# EasyEDA Pro project sensor_board.eprj

# Schematic Schematic1
Board Name: Board1; Create Date: 2025-07-16; Page Name: P1; Project Name: sensor_board; Schematic Name: Schematic1; Update Date: 2025-07-16; Company: EasyEDA.com; Page Size: A4; Version: V1.0
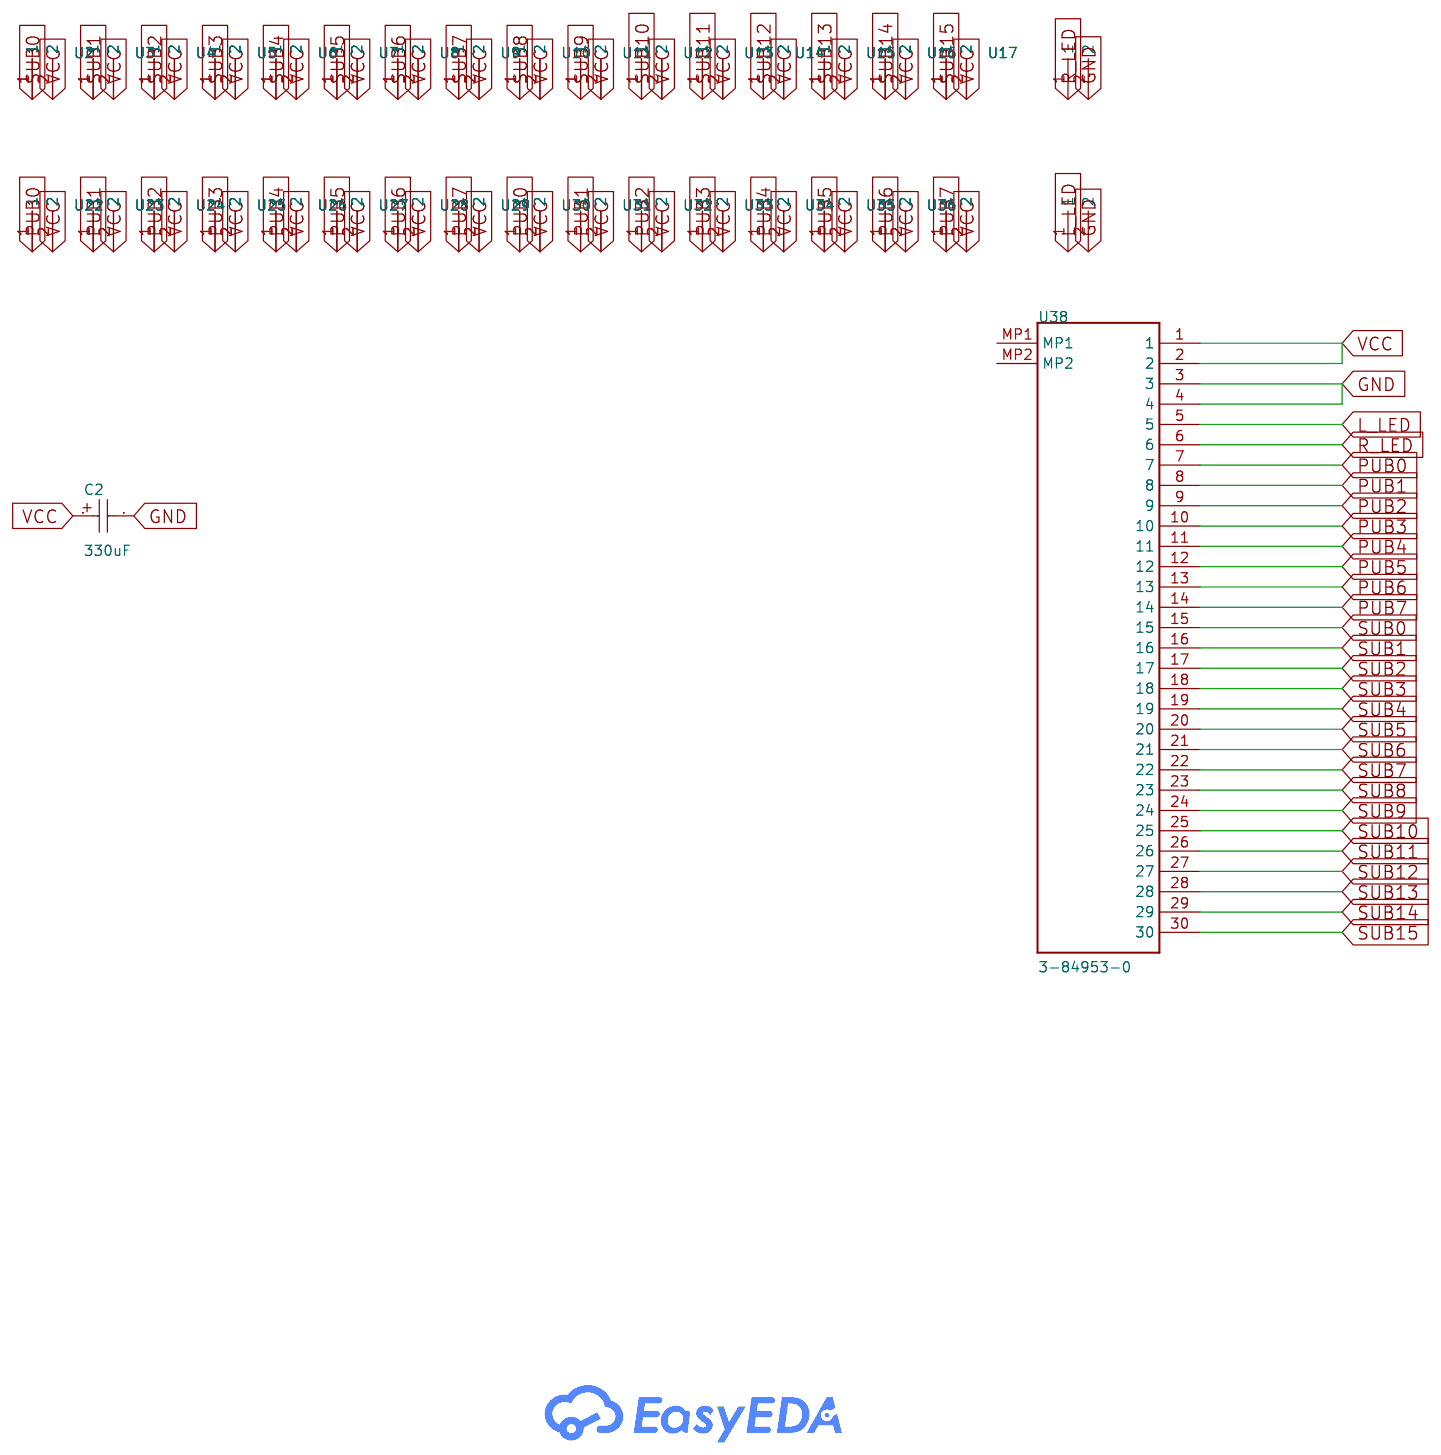
[diagram p0: schematic sheet]

## Parts
C2  330uF  [CASE-D_7343]
U2  -  [pub_pin]
U3  -  [pub_pin]
U4  -  [pub_pin]
U5  -  [pub_pin]
U6  -  [pub_pin]
U7  -  [pub_pin]
U8  -  [pub_pin]
U9  -  [pub_pin]
U10  -  [pub_pin]
U11  -  [pub_pin]
U12  -  [pub_pin]
U13  -  [pub_pin]
U14  -  [pub_pin]
U15  -  [pub_pin]
U16  -  [pub_pin]
U17  -  [pub_pin]
U18  -  [pub_pin]
U21  -  [pub_pin]
U22  -  [pub_pin]
U23  -  [pub_pin]
U24  -  [pub_pin]
U25  -  [pub_pin]
U26  -  [pub_pin]
U27  -  [pub_pin]
U28  -  [pub_pin]
U29  -  [pub_pin]
U30  -  [pub_pin]
U31  -  [pub_pin]
U32  -  [pub_pin]
U33  -  [pub_pin]
U34  -  [pub_pin]
U35  -  [pub_pin]
U36  -  [pub_pin]
U37  -  [pub_pin]
U38  3-84953-0  [3849530]

## Library data of the parts
C2 = TAJD337M006RNJ: Capacitance: Tolerance:±20% Tolerance:±20% Rated Voltage: Equivalent Series Resistance(ESR):400mΩ@100kHz Operating Temperature:-55℃~+125℃ Operating Temperature:-55℃~+125℃; LCSC Part Name: 330uF ±20% 6.3V; Supplier Part: C22283; Manufacturer: Kyocera AVX; Supplier Footprint: CASE-D-7343; JLCPCB Part Class: Extended Part; Datasheet: https://atta.szlcsc.com/upload/public/pdf/source/20160107/1457707750344.pdf; Supplier: LCSC; Tolerance: ±20%; Equivalent Series Resistance(ESR): 400mΩ@100kHz; Operating Temperature: -55℃~+125℃
U2-U18 U21-U37 = pub_pin
U38 = 3-84953-0

## Nets
GND: C2.2 U18.2 U21.2 U38.3 U38.4
VCC: C2.1 U2.2 U3.2 U4.2 U5.2 U6.2 U7.2 U8.2 U9.2 U10.2 U11.2 U12.2 U13.2 U14.2 U15.2 U16.2 U17.2 U22.2 U23.2 U24.2 U25.2 U26.2 U27.2 U28.2 U29.2 U30.2 U31.2 U32.2 U33.2 U34.2 U35.2 U36.2 U37.2 U38.1 U38.2
L_LED: U21.1 U38.5
PUB0: U22.1 U30.1 U38.7
PUB1: U23.1 U31.1 U38.8
PUB2: U24.1 U32.1 U38.9
PUB3: U25.1 U33.1 U38.10
PUB4: U26.1 U34.1 U38.11
PUB5: U27.1 U35.1 U38.12
PUB6: U28.1 U36.1 U38.13
PUB7: U29.1 U37.1 U38.14
R_LED: U18.1 U38.6
SUB0: U2.1 U38.15
SUB1: U3.1 U38.16
SUB2: U4.1 U38.17
SUB3: U5.1 U38.18
SUB4: U6.1 U38.19
SUB5: U7.1 U38.20
SUB6: U8.1 U38.21
SUB7: U9.1 U38.22
SUB8: U10.1 U38.23
SUB9: U11.1 U38.24
SUB10: U12.1 U38.25
SUB11: U13.1 U38.26
SUB12: U14.1 U38.27
SUB13: U15.1 U38.28
SUB14: U16.1 U38.29
SUB15: U17.1 U38.30

Not connected (* = marked no-connect by the designer): U38 MP1 MP2

# Board PCB1
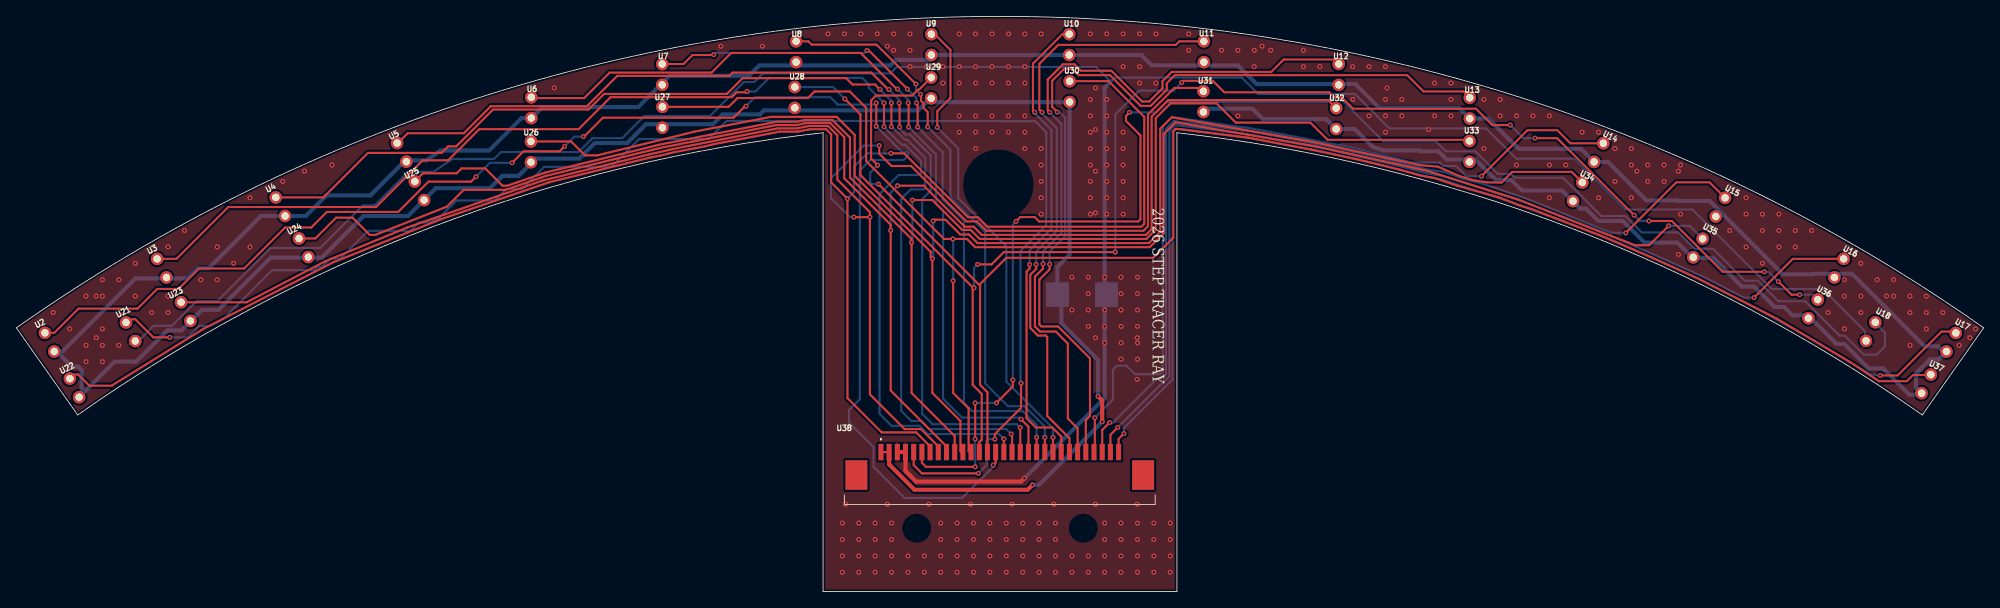
[diagram p1: board, top side]
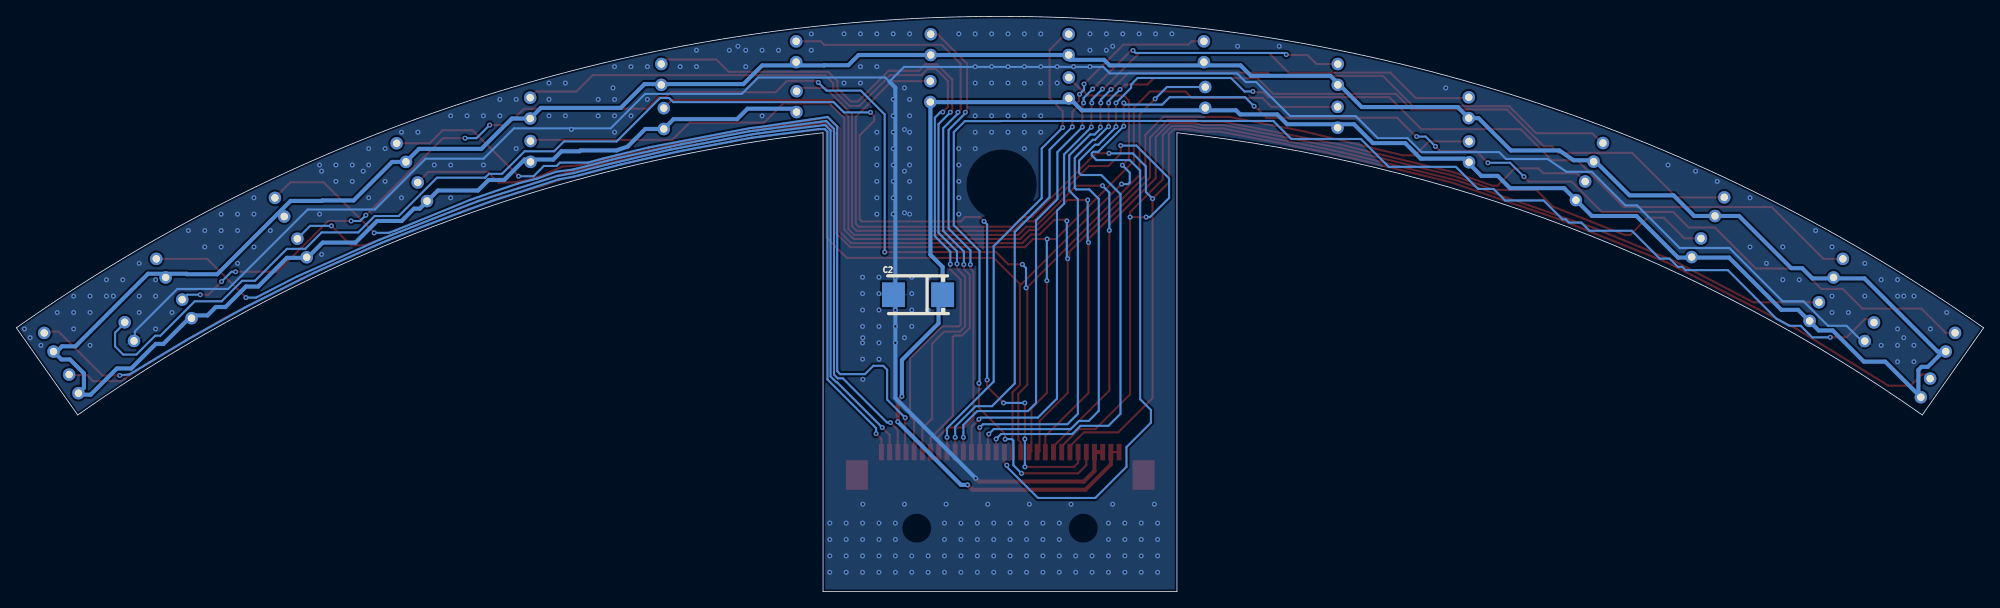
[diagram p2: board, bottom side, seen from below]

Outline 240.02 x 70.19 mm; copper layers: Top Layer, Bottom Layer. Coordinates in mm from the lower left corner of the outline.
Outline path: 0,32.19 7.48,21.56 arc(50.78,44.52) 98.42,55.99 98.42,0 141.6,0 141.6,55.99 arc(189.24,44.52) 232.53,21.56 240.02,32.19 arc(120.01,70.19) 0,32.19
Stack: Top Layer 0.035mm / Dielectric1 1.51mm FR4 er 4.5 / Bottom Layer 0.035mm

## Design rules (mm)
net VCC: VCC
template: JLCPCB Capability(Two Layers Board)
spacing copperThickness1oz (default): track to track 0.102, other pairs 0.152 to 0.3
spacing copperThickness2oz: track to track 0.203, other pairs 0.152 to 0.3
track width copperThickness1oz (default): min 0.127, default 0.254, max 2.54
track width copperThickness2oz: min 0.203, default 0.254, max 2.54
differential pair differentialPair (default): width min 0.127, default 0.254, max 2.54; gap min 0.152, default 0.152
via viaSize (default): diameter min 0.5, default 0.61, max 10; hole min 0.3, default 0.305, max 6.3

## Placement (name value [footprint] x y rotation side)
C2  330uF  [CASE-D_7343]  130.01 36.23 180 bottom
U2  -  [pub_pin]  23.76 24.25 26.6 top
U3  -  [pub_pin]  37.45 33.28 26.6 top
U4  -  [pub_pin]  51.92 40.78 26.6 top
U5  -  [pub_pin]  66.72 47.41 26.6 top
U6  -  [pub_pin]  77.68 44.69 0 top
U7  -  [pub_pin]  93.65 48.75 0 top
U8  -  [pub_pin]  109.99 51.52 0 top
U9  -  [pub_pin]  126.49 52.39 0 top
U10  -  [pub_pin]  143.32 52.39 0 top
U11  -  [pub_pin]  159.74 51.52 0 top
U12  -  [pub_pin]  176.19 48.75 0 top
U13  -  [pub_pin]  192.19 44.64 0 top
U14  -  [pub_pin]  199.93 34.09 333.4 top
U15  -  [pub_pin]  214.78 27.43 333.4 top
U16  -  [pub_pin]  229.25 19.99 333.4 top
U17  -  [pub_pin]  242.93 10.95 333.4 top
U18  -  [pub_pin]  233.11 12.25 333.4 top
U21  -  [pub_pin]  33.65 25.52 26.6 top
U22  -  [pub_pin]  26.8 18.67 26.6 top
U23  -  [pub_pin]  40.37 27.98 26.6 top
U24  -  [pub_pin]  54.76 35.77 26.6 top
U25  -  [pub_pin]  68.89 42.72 26.6 top
U26  -  [pub_pin]  77.64 39.31 0 top
U27  -  [pub_pin]  93.68 43.53 0 top
U28  -  [pub_pin]  109.83 45.95 0 top
U29  -  [pub_pin]  126.47 47.11 0 top
U30  -  [pub_pin]  143.37 46.66 0 top
U31  -  [pub_pin]  159.69 45.44 0 top
U32  -  [pub_pin]  175.89 43.37 0 top
U33  -  [pub_pin]  192.15 39.36 0 top
U34  -  [pub_pin]  197.36 29.31 333.4 top
U35  -  [pub_pin]  212.04 22.45 333.4 top
U36  -  [pub_pin]  226.09 15.02 333.4 top
U37  -  [pub_pin]  239.89 5.87 333.4 top
U38  3-84953-0  [3849530]  119.98 16.03 0 top

## Footprints (pads in the part's own frame, mm; a bottom-side part is the same pattern mirrored in y, then rotated)
3849530
  rect 0.61x2 smd: 1(-14.5,1) 2(-13.5,1) 3(-12.5,1) 4(-11.5,1) 5(-10.5,1) 6(-9.5,1) 7(-8.5,1) 8(-7.5,1) 9(-6.5,1) 10(-5.5,1) 11(-4.5,1) 12(-3.5,1) 13(-2.5,1) 14(-1.5,1) 15(-0.5,1) 16(0.5,1) 17(1.5,1) 18(2.5,1) 19(3.5,1) 20(4.5,1) 21(5.5,1) 22(6.5,1) 23(7.5,1) 24(8.5,1) 25(9.5,1) 26(10.5,1) 27(11.5,1) 28(12.5,1) 29(13.5,1) 30(14.5,1)
  rect 2.68x3.6 smd: MP1(-17.49,-1.8) MP2(17.49,-1.8)
CASE-D_7343
  rect 2.799x3.01 smd: 1(3,0) 2(-3,0)
pub_pin
  round 1.524 hole 0.914: 1(-14.859,15.621) 2(-14.859,13.081)

## Nets
As in the schematic.

Pads without a net: U38 MP1 MP2

## Via types
v1: diameter 0.61, hole 0.305, Top Layer to Bottom Layer, 409 vias

## Routing (per net, layer and track width the routed paths; a pad name or vN(x,y) marks a point on that pad's centre or on a via; arc(x,y) is an arc through that point)
GND: length 311
  Top Layer w0.5: v1(122.98,13.83) 122.58,13.43 109.78,13.43 108.48,14.73 U38.4 U38.3
  Bottom Layer w0.254: 225.57,30.59 225.57,31.74 220.38,36.93 214.18,36.93 204.48,46.63 196.28,46.63 190.08,52.83 183.01,52.83 179.31,56.53 167.51,56.53 163.31,60.73 151.51,60.73 149.51,62.73 134.01,62.73 133.51,62.23 131.71,64.03 107.41,64.03 106.61,63.23 91.08,63.23 90.03,62.18 88.76,62.18 84.61,58.03 76.61,58.03 73.91,55.33 70.28,55.33 68.58,53.63 59.11,53.63 58.27,52.79 53.2,52.79 50.89,51.23 47.81,51.23 43.71,47.13 42.28,47.13 37.08,41.93 31.01,41.93 24.51,35.43 21.98,35.43 18.98,32.43 16.71,32.43 14.75,30.47 14.61,30.47 U21.2
  Bottom Layer w0.5: 133.51,62.23 132.78,61.5 132.78,23.63 v1(122.98,13.83)
  vias: v1(4.5,34.05) v1(6.5,32.05) v1(8.5,36.05) v1(8.5,30.05) v1(8.5,28.05) v1(9.74,36.06) v1(9.74,30.98) v1(10.5,38.05) v1(10.5,36.05) v1(10.5,32.05) v1(10.5,30.05) v1(10.5,28.05) v1(12.5,38.05) v1(12.5,30.05) v1(14.5,40.05) v1(14.5,36.05) v1(16.5,34.05) v1(18.5,42.05) v1(18.5,36.05) v1(18.5,34.05) v1(20.5,44.05) v1(22.5,38.05) v1(24.5,42.05) v1(24.5,38.05) v1(26.5,40.05) v1(28.5,48.05) v1(28.5,42.05) v1(32.5,50.05) v1(35.14,51.3) v1(38.5,52.05) v1(65.62,61.46) v1(85.94,66.54) v1(91.02,66.54) v1(99.03,68.05) v1(100.78,8.36) v1(100.78,6.36) v1(100.78,4.36) v1(100.78,2.36) v1(101.03,68.05) v1(101.18,10.66) v1(102.78,8.36) v1(102.78,6.36) v1(102.78,4.36) v1(102.78,2.36) v1(103.03,68.05) v1(104.78,8.36) v1(104.78,6.36) v1(104.78,4.36) v1(104.78,2.36) v1(105.03,68.05) v1(106.26,66.54) v1(106.26,10.66) v1(106.78,8.36) v1(106.78,6.36) v1(106.78,4.36) v1(106.78,2.36) v1(107.03,68.05) v1(107.03,66.05) v1(108.78,4.36) v1(108.78,2.36) v1(109.03,68.05) v1(109.03,66.05) v1(109.03,64.05) v1(110.78,4.36) v1(110.78,2.36) v1(111.03,64.05) v1(111.34,10.66) v1(112.78,8.36) v1(112.78,6.36) v1(112.78,4.36) v1(112.78,2.36) v1(113.03,64.05) v1(113.03,62.05) v1(114.78,8.36) v1(114.78,6.36) v1(114.78,4.36) v1(114.78,2.36) v1(115.03,68.05) v1(115.03,64.05) v1(115.03,62.05) v1(115.03,58.05) v1(115.03,56.05) v1(116.42,10.66) v1(116.78,8.36) v1(116.78,6.36) v1(116.78,4.36) v1(116.78,2.36) v1(117.03,68.05) v1(117.03,64.05) v1(117.03,62.05) v1(117.03,58.05) v1(117.03,56.05) v1(117.03,54.05) v1(118.78,8.36) v1(118.78,6.36) v1(118.78,4.36) v1(118.78,2.36) v1(119.03,68.05) v1(119.03,64.05) v1(119.03,62.05) v1(119.03,58.05) v1(119.03,56.05) v1(120.78,8.36) v1(120.78,6.36) v1(120.78,4.36) v1(120.78,2.36) v1(121.03,68.05) v1(121.03,64.05) v1(121.03,62.05) v1(121.03,58.05) v1(121.03,56.05) v1(121.5,10.66) v1(122.78,8.36) v1(122.78,6.36) v1(122.78,4.36) v1(122.78,2.36) v1(123.03,68.05) v1(123.03,64.05) v1(123.03,62.05) v1(123.03,58.05) v1(123.03,56.05) v1(123.03,54.05) v1(124.78,8.36) v1(124.78,6.36) v1(124.78,4.36) v1(124.78,2.36) v1(125.03,68.05) v1(125.03,54.05) v1(125.03,52.05) v1(125.03,50.05) v1(125.03,48.05) v1(125.03,46.05) v1(126.58,10.66) v1(126.78,8.36) v1(126.78,6.36) v1(126.78,4.36) v1(126.78,2.36) v1(128.78,38.36) v1(128.78,34.36) v1(128.78,4.36) v1(128.78,2.36) v1(130.78,38.36) v1(130.78,36.36) v1(130.78,34.36) v1(130.78,32.36) v1(130.78,4.36) v1(130.78,2.36) v1(131.03,68.05) v1(131.03,60.05) v1(131.03,58.05) v1(131.03,56.05) v1(131.03,54.05) v1(131.03,52.05) v1(131.03,50.05) v1(131.03,48.05) v1(131.03,46.05) v1(131.66,61.46) v1(131.66,56.38) v1(131.66,51.3) v1(131.66,46.22) v1(131.66,30.98) v1(131.66,10.66) v1(132.78,38.36) v1(132.78,34.36) v1(132.78,32.36) v1(132.78,30.36) v1(132.78,8.36) v1(132.78,6.36) v1(132.78,4.36) v1(132.78,2.36) v1(133.03,68.05) v1(133.03,60.05) v1(133.03,58.05) v1(133.03,56.05) v1(133.03,54.05) v1(133.03,52.05) v1(133.03,50.05) v1(133.03,48.05) v1(133.03,46.05) v1(134.78,38.36) v1(134.78,36.36) v1(134.78,34.36) v1(134.78,32.36) v1(134.78,30.36) v1(134.78,28.36) v1(134.78,8.36) v1(134.78,6.36) v1(134.78,4.36) v1(134.78,2.36) v1(135.03,68.05) v1(135.03,64.05) v1(135.03,56.05) v1(135.03,54.05) v1(135.03,52.05) v1(135.03,50.05) v1(135.03,48.05) v1(135.03,46.05) v1(136.78,38.36) v1(136.78,36.36) v1(136.78,34.36) v1(136.78,32.36) v1(136.74,30.98) v1(136.78,30.36) v1(136.78,28.36) v1(136.74,25.9) v1(136.74,10.66) v1(136.78,8.36) v1(136.78,6.36) v1(136.78,4.36) v1(136.78,2.36) v1(137.03,68.05) v1(137.03,64.05) v1(137.03,62.05) v1(138.78,8.36) v1(138.78,6.36) v1(138.78,4.36) v1(138.78,2.36) v1(139.03,68.05) v1(139.03,62.05) v1(140.78,8.36) v1(140.78,6.36) v1(140.78,4.36) v1(140.78,2.36) v1(143.03,68.05) v1(143.03,66.05) v1(147.03,66.05) v1(149.03,66.05) v1(149.03,58.05) v1(151.03,66.05) v1(151.03,64.05) v1(151.98,66.54) v1(153.03,66.05) v1(157.03,66.05) v1(157.03,64.05) v1(159.03,64.05) v1(163.03,64.05) v1(163.03,60.05) v1(165.03,64.05) v1(165.03,58.05) v1(167.03,64.05) v1(167.03,60.05) v1(167.03,58.05) v1(167.03,56.05) v1(167.22,61.46) v1(169.03,60.05) v1(169.03,58.05) v1(172.3,56.38) v1(173.03,62.05) v1(173.03,58.05) v1(175.03,62.05) v1(175.03,60.05) v1(175.03,58.05) v1(179.03,60.05) v1(179.03,54.05) v1(181.03,60.05) v1(181.03,58.05) v1(183.03,58.05) v1(183.03,52.05) v1(185.03,58.05) v1(187.03,58.05) v1(187.03,52.05) v1(187.03,48.05) v1(189.03,52.05) v1(191.03,56.05) v1(193.03,56.05) v1(193.03,48.05) v1(195.03,54.05) v1(195.03,50.05) v1(197.03,54.05) v1(197.03,52.05) v1(197.03,48.05) v1(197.7,51.3) v1(199.03,52.05) v1(199.03,50.05) v1(201.03,52.05) v1(201.03,50.05) v1(202.78,51.3) v1(202.78,41.14) v1(203.03,52.05) v1(203.03,46.05) v1(209.03,44.05) v1(211.03,48.05) v1(211.03,46.05) v1(211.03,42.05) v1(213.03,46.05) v1(213.03,44.05) v1(213.03,40.05) v1(215.03,46.05) v1(215.03,44.05) v1(215.03,42.05) v1(217.03,44.05) v1(217.03,42.05) v1(219.03,44.05) v1(221.03,34.05) v1(223.03,38.05) v1(223.03,36.05) v1(223.03,32.05) v1(225.03,40.05) v1(225.03,36.05) v1(225.03,34.05) v1(227.04,38.05) v1(228.18,36.06) v1(229.04,38.05) v1(229.04,36.05) v1(231.04,36.05) v1(231.04,34.05) v1(231.04,30.05) v1(233.04,36.05) v1(233.04,34.05) v1(233.04,32.05) v1(235.04,34.05) v1(237.04,30.05) v1(238.34,30.98) v1(239.04,32.05)
VCC: length 587.7
  Top Layer w0.254: U38.1 U38.2
  Top Layer w0.5: U38.2 106.48,15.53 109.58,12.43 123.38,12.43 v1(123.98,13.03) ; v1(132.48,20.73) 132.48,23.33 v1(131.98,23.83)
  Bottom Layer w0.254: 128.01,59.62 128.03,59.64 ; 235.49,29.29 235.29,29.09
  Bottom Layer w0.5: U31.2 145.23,58.92 150.82,58.92 152.09,57.65 159.83,57.65 U32.2 163.29,56.45 165.44,54.29 166.79,53.84 171.19,53.84 171.3,53.73 173.51,53.73 174.51,52.73 178.01,52.73 180.51,50.23 182.4,50.23 183.69,48.94 188.59,48.94 190.8,46.73 191.51,46.73 193.01,45.23 196.01,45.23 198.64,42.59 202.64,42.59 204.51,40.73 207.01,40.73 210.51,37.23 212.01,37.23 214.51,34.73 215.68,34.73 216.71,33.7 218.6,33.7 222.08,30.23 223.01,30.23 226.01,27.23 227.76,27.23 230.96,24.03 232.31,24.03 ; 4.92,29.3 5.62,29.3 14.53,38.22 20.88,38.22 22.13,39.46 23.46,39.46 29.84,45.84 35.32,45.84 37.83,48.35 43.2,48.35 47.48,52.63 50.02,52.63 51.76,53.83 57.68,53.83 61.63,57.77 U6.2 64.17,59.12 75.88,59.12 79.69,62.93 89.39,62.93 90.66,64.2 106.63,64.2 107.31,64.89 111.45,64.89 112.03,65.47 U10.2 137.26,65.47 138.51,64.23 141.46,64.23 141.48,64.2 149.03,64.2 151.31,61.93 163.38,61.93 166.28,59.02 176.03,59.02 U13.2 179.58,57.72 183.28,54.02 190.9,54.02 192.49,52.43 194.17,52.43 198.88,47.73 202.68,47.73 202.74,47.67 206.56,47.67 215.51,38.73 219.19,38.73 219.25,38.78 223.95,38.78 232.8,29.93 234.45,29.93 235.29,29.09 234.52,28.33 233.48,28.33 231.78,26.63 231.78,24.88 232.45,24.21 ; 4.92,29.3 6.79,27.43 7.58,27.43 7.96,27.05 7.96,24.02 ; 4.92,29.3 4.62,29.3 ; v1(131.98,23.83) 131.98,28.26 127.51,32.73 127.51,35.73 C2.1 127.01,39.62 128.5,41.11 128.5,59.13 128.01,59.62 ; 7.96,24.02 11.99,28.06 14.6,28.06 18.41,31.87 20.12,31.87 22.63,34.38 24.67,34.38 31.04,40.76 37.27,40.76 42.35,45.84 47.79,45.84 51.18,49.23 57.78,49.23 59.28,50.73 61.28,50.73 63.38,52.83 68.67,52.83 70.57,54.73 74.51,54.73 76.81,57.03 84.98,57.03 86.18,58.23 90.71,58.23 91.21,58.73 110.04,58.73 111.04,59.73 127.94,59.73 128.03,59.64 ; 7.96,24.02 7.66,23.72 ; v1(132.48,20.73) 124.78,13.03 v1(123.98,13.03)
L_LED: length 180.4
  Top Layer w0.254: v1(117.38,14.43) 110.48,14.43 109.48,15.43 U38.5 ; v1(122.58,25.43) 122.58,22.43 119.38,19.23 v1(119.38,18.61) ; v1(18.71,31.03) 16.71,31.03 14.51,33.23 13.76,33.23 U21.1
  Bottom Layer w0.254: v1(18.71,31.03) 20.91,31.03 22.31,32.43 23.67,32.43 25.28,33.29 31.21,39.23 36.38,39.23 36.78,39.63 37.31,39.63 38.31,40.63 39.51,40.63 42.91,44.03 48.08,44.03 49.08,45.03 50.58,45.03 50.98,45.43 51.38,45.43 53.68,47.73 58.38,47.73 59.78,49.13 61.68,49.13 64.38,51.83 72.58,51.83 75.98,55.23 84.46,55.23 86.66,57.43 119.96,57.43 119.98,57.41 124.3,57.41 125.65,56.06 125.65,44.72 122.51,41.58 122.51,25.23 ; v1(117.38,14.43) 118.38,15.43 118.38,18.43 118.56,18.61 v1(119.38,18.61)
PUB0: length 214.5
  Top Layer w0.254: 128.18,62.28 133.25,62.28 137.61,57.93 137.61,44.88 137.26,44.53 118.46,44.53 117.31,45.68 116.11,45.68 108.31,53.48 v1(106.71,53.48) ; 111.48,16.83 111.48,17.73 109.78,19.43 105.58,19.43 101.39,23.61 v1(101.39,47.94) 99.41,49.93 99.41,55.81 98.8,56.42 96.83,56.42 95.31,56.13 93.13,56.13 85.14,54.61 84.01,54.33 80.31,53.63 78.53,53.19 77.36,52.97 65,49.95 51.8,45.44 38.68,40.19 22.88,32.09 11.61,25.13 8.91,25.13 7.54,26.49 7.02,26.49
  Bottom Layer w0.254: v1(101.39,47.94) 102.21,48.76 102.21,51.88 103.81,53.48 v1(106.71,53.48)
PUB1: length 204.9
  Top Layer w0.254: v1(105.28,54.43) 105.28,53.43 106.78,51.93 109.16,51.93 115.91,45.18 117.19,45.18 118.34,44.03 137.51,44.03 138.06,44.58 138.06,58.23 141.29,61.46 144.43,61.46 U31.1 ; 112.48,16.83 112.48,17.73 110.38,19.83 108.38,19.83 104.13,24.07 v1(104.13,45.69) ; v1(104.13,45.69) 104.13,46.3 100.16,50.28 100.16,55.69 99.04,56.81 96.64,56.81 95.31,56.53 92.91,56.53 80.21,54.03 77.11,53.33 64.11,50.13 47.68,44.43 37.68,40.31 28.08,35.3 U23.1 ; v1(104.13,45.69) v1(102.18,45.69)
  Bottom Layer w0.254: v1(105.28,54.43) 103.38,54.43 99.38,50.43 99.38,48.03 101.71,45.69 v1(102.18,45.69)
PUB2: length 192.5
  Top Layer w0.254: U32.1 160.04,59.98 140.53,59.98 138.51,57.96 138.51,44.23 137.81,43.53 117.79,43.53 116.79,44.53 115.71,44.53 110.71,49.53 v1(107.51,49.53) ; 113.48,16.83 113.48,17.73 106.67,24.53 v1(106.67,44.07) 106.67,44.76 101.01,50.43 101.01,55.47 99.31,57.17 96.29,57.17 95.21,56.93 92.71,56.93 78.51,54.13 64.61,50.73 59.71,49.03 54.58,49.03 52.53,46.98 43.79,43.53 43.11,43.53 41.01,45.63 39.02,45.63 36.48,43.09 U24.1
  Bottom Layer w0.254: v1(106.67,44.07) 106.67,48.69 v1(107.51,49.53)
PUB3: length 192.2
  Top Layer w0.254: U25.1 49.61,51.04 53.71,51.04 54.31,51.64 57.2,51.64 59.31,49.53 59.91,49.53 64.51,51.13 78.41,54.53 92.71,57.33 95.21,57.33 96.24,57.56 99.55,57.56 101.71,55.4 101.71,50.53 109.21,43.02 v1(109.21,42.6) 109.21,24.25 114.48,18.98 114.48,16.83 ; U33.1 177.14,55.13 159.98,55.13 157.88,57.23 148.78,57.23 146.43,59.58 140.81,59.58 139.01,57.78 139.01,44.18 137.86,43.03 117.54,43.03 116.44,44.13 115.41,44.13 111.76,47.78 v1(109.31,47.78)
  Bottom Layer w0.254: v1(109.31,47.78) 109.31,42.7 v1(109.21,42.6)
PUB4: length 186.8
  Top Layer w0.254: U26.1 67.67,54.93 69.38,53.23 70.85,53.23 82.8,56.14 92.06,57.93 100.08,57.93 102.28,55.73 102.28,50.73 111.55,41.45 111.55,40.83 v1(111.75,40.63) 111.75,24.25 115.18,20.82 115.18,17.13 115.48,16.83 ; U34.1 189.76,51.21 182.5,51.21 181.19,49.9 179.37,49.94 177.69,50.21 176.09,50.69 173.41,51.86 171.29,52.03 158.23,54.87 140.96,57.88 139.56,56.48 139.56,43.91 138.18,42.53 117.28,42.53 116.23,43.58 115.16,43.58 113.36,45.38 112,45.38 v1(111.85,45.23)
  Bottom Layer w0.254: v1(111.85,45.23) 111.85,40.73 v1(111.75,40.63)
PUB5: length 183.7
  Top Layer w0.254: v1(201.58,44.63) 199.21,42.26 197.49,42.26 183.28,47.83 172.18,51.33 158.58,54.33 141.41,57.25 139.98,55.83 139.98,43.73 138.28,42.03 116.98,42.03 115.98,43.03 v1(114.26,43.03) 113.18,43.03 103.68,52.53 103.68,59.03 101.68,61.03 97.38,61.03 96.58,60.23 87.98,60.23 86.9,59.15 78.82,59.15 ; v1(114.29,37.94) 114.29,24.25 116.18,22.36 116.18,17.13 116.48,16.83
  Bottom Layer w0.254: v1(114.29,37.94) 114.29,42.99 v1(114.26,43.03) ; U35.1 204.17,44.63 v1(201.58,44.63)
PUB6: length 192.8
  Top Layer w0.254: v1(185.28,55.33) 187.98,55.33 v1(197.38,45.93) ; v1(214.98,37.83) 216.58,36.23 v1(217.58,36.23) ; v1(199.18,45.23) 201.98,45.23 208.18,39.03 v1(213.28,39.03) ; U38.13 117.48,18.23 117.78,18.53 117.78,24.13 116.68,25.23 116.68,36.92 v1(116.83,37.07) 116.73,37.07 102.98,50.83 102.98,58.23 v1(101.08,60.13) ; v1(142.18,62.13) 142.38,62.33 145.98,62.33 147.38,60.93 160.18,60.93 160.78,60.33 161.68,60.33 163.08,58.93 178.08,58.93 180.08,56.93 v1(182.28,56.93) ; v1(117.28,39.93) 118.98,39.93 120.48,41.43 v1(134.08,41.43)
  Bottom Layer w0.254: v1(217.58,36.23) 219.19,36.23 219.78,35.63 ; v1(182.28,56.93) 183.88,55.33 v1(185.28,55.33) ; v1(134.08,41.43) 134.08,58.23 136.98,61.13 141.18,61.13 v1(142.18,62.13) ; v1(213.28,39.03) 213.78,39.03 v1(214.98,37.83) ; v1(117.28,39.93) 116.83,39.48 v1(116.83,37.07) ; v1(197.38,45.93) 198.08,45.23 v1(199.18,45.23) ; v1(101.08,60.13) 99.64,61.57 U28.1
PUB7: length 196.8
  Top Layer w0.254: 117.58,37.33 117.58,37.53 120.78,40.73 138.71,40.73 141.16,43.18 141.16,56.18 141.46,56.48 150.31,55.38 158.26,53.88 163.66,52.73 168.81,51.48 171.28,50.78 172.99,50.48 175.83,49.51 180.94,48.09 183.46,47.1 184.81,46.7 193.49,43.36 199.51,40.78 205.27,38.16 214.73,33.34 223.84,27.93 227.26,25.68 230.66,25.68 231.41,26.43 233.63,26.43 233.68,26.48 ; 117.58,37.33 v1(105.18,49.73) ; 117.58,37.33 117.58,25.23 118.48,24.33 U38.14 ; v1(105.08,52.03) 104.28,52.83 104.28,59.93 104.88,60.53 109.28,60.53 109.98,61.23 110.11,61.23 U29.1
  Bottom Layer w0.254: v1(105.08,52.03) 104.18,51.13 104.18,49.93 104.38,49.73 v1(105.18,49.73)
R_LED: length 181
  Top Layer w0.254: v1(119.58,23.03) 121.58,25.03 v1(121.58,25.83) ; v1(121.96,45.18) 122.49,45.71 124.24,45.71 124.78,45.17 136.88,45.17 137.14,45.42 137.14,55.67 135.37,57.44 135.37,58.04 v1(135.81,58.48) ; U38.6 110.48,15.73 110.98,15.23 v1(116.98,15.23) ; v1(116.98,18.63) v1(116.98,23.03)
  Bottom Layer w0.254: v1(121.96,45.18) 121.58,44.8 v1(121.58,25.83) ; v1(135.81,58.48) 139.06,58.48 140.31,59.73 159.88,59.73 160.38,60.23 161.48,60.23 166.78,54.93 173.21,54.93 174.41,53.73 178.01,53.73 180.76,50.98 182.36,50.98 182.83,50.51 188.7,50.51 193.38,45.83 196.31,45.83 198.31,43.83 202.78,43.83 204.78,41.83 207.01,41.83 210.91,37.93 212.48,37.93 214.98,35.43 218.25,35.43 222.45,31.23 223.08,31.23 225.38,28.93 226.98,28.93 227.98,29.93 227.98,31.59 226.7,32.86 ; v1(116.98,15.23) v1(116.98,18.63) ; v1(116.98,23.03) v1(119.58,23.03)
SUB0: length 186.3
  Top Layer w0.254: v1(56.08,50.63) 55.48,50.03 50.28,50.03 46.58,46.33 37.88,46.33 35.98,44.43 32.78,44.43 27.78,39.43 22.28,39.43 19.78,36.93 17.18,36.93 14.78,34.53 7.58,34.53 4.62,31.57 U2.1 ; 119.48,16.83 119.48,15.73 v1(119.18,15.43) ; v1(66.88,54.33) 66.28,53.73 61.88,53.73 v1(60.48,52.33) ; 89.01,59.33 87.51,57.83 71.56,57.83 69.16,55.43 ; v1(104.91,56.78) v1(104.91,59.63)
  Bottom Layer w0.254: v1(119.18,15.43) 119.18,15.23 115.38,11.43 108.38,11.43 104.58,15.23 104.58,17.63 101.59,20.61 101.59,22.16 102.91,23.48 102.91,51.38 104.18,52.65 108.23,52.65 108.81,53.23 108.81,53.48 108.63,53.66 108.03,53.66 v1(104.91,56.78) ; v1(66.88,54.33) 68.08,55.53 v1(69.18,55.53) ; v1(60.48,52.33) 57.78,52.33 v1(56.08,50.63) ; v1(104.91,59.63) 104.71,59.43 100.21,59.43 99.31,60.33 90.11,60.33 v1(89.01,59.23)
SUB1: length 160.9
  Top Layer w0.254: U3.1 19.53,40.6 25.85,46.93 43.88,46.93 49.58,52.63 52.68,52.63 56.48,56.43 68.6,56.43 72.5,60.33 87.28,60.33 87.88,60.93 89.16,60.93 ; U38.16 v1(120.48,18.63) ; v1(105.86,56.73) v1(105.86,59.63)
  Bottom Layer w0.254: v1(105.86,56.73) 105.86,56.68 108.01,54.53 108.41,54.53 110.36,52.58 110.36,51.08 110.1,50.83 107.64,50.83 105.31,48.5 105.31,21.7 106.78,20.23 110.18,20.23 111.18,19.23 119.88,19.23 v1(120.48,18.63) ; v1(89.16,61.03) 90.18,61.03 91.83,62.68 103.21,62.68 104.01,61.88 104.01,61.48 v1(105.86,59.63)
SUB2: length 141
  Top Layer w0.254: U38.17 121.48,19.13 v1(121.38,19.23) ; v1(105.36,61.28) 104.76,61.88 102.01,61.88 101.23,62.65 88.6,62.65 86.68,60.73 71.71,60.73 69.81,58.83 58.16,58.83 53.66,54.33 52.68,54.33 51.88,53.53 42.88,53.53 37.46,48.1 U4.1 ; v1(106.76,56.73) v1(106.76,59.63)
  Bottom Layer w0.254: v1(121.38,19.23) 120.78,19.83 111.38,19.83 110.38,20.83 109.18,20.83 107.96,22.05 107.96,47.92 109.11,49.08 110.71,49.08 110.89,49.26 110.89,52.93 108.69,55.13 108.41,55.13 106.81,56.73 v1(106.76,56.73) ; v1(105.36,61.28) 106.76,59.88 v1(106.76,59.63)
SUB3: length 122.6
  Top Layer w0.254: v1(107.76,56.68) 107.76,59.58 v1(107.71,59.63) ; 106.46,61.18 104.31,63.33 87.38,63.33 86.98,62.93 73.31,62.93 69.61,59.23 57.86,59.23 57.86,59.21 54.59,55.93 47.74,55.93 46.44,54.63 ; U38.18 v1(122.48,20.03)
  Bottom Layer w0.254: v1(122.48,20.03) 122.08,20.43 111.78,20.43 110.51,21.7 110.51,47.88 111.56,48.93 111.56,53.23 109.01,55.78 108.46,55.78 107.76,56.48 v1(107.76,56.68) ; v1(107.71,59.63) 107.71,60.03 v1(106.46,61.28)
SUB4: length 103.9
  Top Layer w0.254: U38.19 123.48,20.13 v1(122.58,21.03) ; v1(108.81,59.63) 108.86,59.58 v1(108.86,56.68) ; 62.82,60.21 69.27,60.21 72.38,63.33 84.81,63.33 87.21,65.73 103.01,65.73 107.51,61.23
  Bottom Layer w0.254: v1(108.81,59.63) 108.81,60.03 v1(107.51,61.33) ; v1(122.58,21.03) 122.38,21.23 115.38,21.23 113.06,23.55 113.06,46.48 112.19,47.35 112.19,53.35 v1(108.86,56.68)
SUB5: length 86.8
  Top Layer w0.254: v1(109.96,56.68) 109.96,59.48 v1(109.81,59.63) ; v1(108.71,61.33) 104.01,66.03 ; v1(85.08,65.53) 85.03,65.47 82.5,65.47 81.4,64.37 U7.1 ; U38.20 v1(124.48,18.83)
  Bottom Layer w0.254: v1(124.48,18.83) 124.48,20.33 122.78,22.03 116.6,22.03 115.61,23.02 115.61,45.28 113.01,47.88 113.01,53.63 v1(109.96,56.68) ; v1(108.71,61.33) 109.81,60.23 v1(109.81,59.63) ; v1(103.78,66.03) 103.48,65.73 85.28,65.73 v1(85.08,65.53)
SUB6: length 69.4
  Top Layer w0.254: U38.21 v1(125.48,18.83) ; v1(109.76,61.93) 104.94,66.74 97.03,66.74 96.63,67.14 U8.1 ; v1(110.31,60.68) 110.38,60.61 110.38,59.88 110.68,59.58 110.68,59.03 111.18,58.52 v1(111.18,56.7)
  Bottom Layer w0.254: v1(125.48,18.83) 125.48,20.13 122.98,22.63 120.98,22.63 118.21,25.4 118.21,43.88 113.96,48.13 113.96,53.93 v1(111.18,56.7) ; v1(110.31,60.68) 109.76,61.23 v1(109.76,61.93)
SUB7: length 58.3
  Top Layer w0.254: v1(112.36,56.63) 112.36,58.63 113.96,60.23 113.96,66.09 112.03,68.01 ; U38.22 v1(126.48,18.83)
  Bottom Layer w0.254: v1(112.36,56.63) 114.92,54.06 114.92,48 120.78,42.15 120.78,25.63 126.48,19.93 v1(126.48,18.83)
SUB8: length 58.2
  Top Layer w0.254: 128.03,68.01 127.62,68.01 124.03,64.43 124.03,58.7 v1(124.24,58.49) ; v1(123.62,39.91) 123.62,39.42 123.25,39.05 123.25,21.16 124.38,20.03 126.38,20.03 127.48,18.93 127.48,16.83
  Bottom Layer w0.254: v1(124.24,58.49) 124.24,58.37 126.28,56.33 126.28,44.3 123.62,41.64 v1(123.62,39.91)
SUB9: length 73.5
  Top Layer w0.254: U11.1 141.88,67.14 141.44,66.71 127.12,66.71 124.81,64.4 124.81,58.82 v1(125.14,58.49) ; 128.48,16.83 128.48,18.73 125.77,21.44 125.77,31.07 125.59,31.25 124.63,31.25 123.7,32.18 123.7,38.66 124.42,39.38 v1(124.42,39.92)
  Bottom Layer w0.254: v1(125.14,58.49) 125.14,58.34 126.94,56.54 126.94,44.02 124.42,41.5 v1(124.42,39.92)
SUB10: length 92
  Top Layer w0.254: U12.1 160.78,64.93 154.62,64.93 153.11,63.42 140.96,63.42 139.84,62.3 139.84,61.43 138.22,59.81 137.35,59.81 133.6,63.56 129.88,63.56 129.1,64.34 127.69,64.34 125.83,62.48 125.83,58.73 v1(126.07,58.49) ; v1(125.26,40) 125.26,39.42 124.27,38.43 124.27,32.36 124.9,31.73 126.82,31.73 128.29,30.26 128.29,21.12 129.48,19.93 129.48,16.83
  Bottom Layer w0.254: v1(125.26,40) 125.26,41.52 127.51,43.77 127.51,57.05 v1(126.07,58.49)
SUB11: length 108.2
  Top Layer w0.254: U13.1 176.57,61.03 171.68,61.03 169.69,63.02 141.34,63.02 140.36,62.03 140.36,61.24 138.38,59.27 137.17,59.27 133.42,63.02 129.61,63.02 128.86,63.77 127.81,63.77 126.37,62.33 126.37,59.15 v1(127,58.52) ; 130.48,16.83 130.48,20.93 130.99,21.44 130.99,28.46 127.09,32.36 125.05,32.36 124.82,32.59 124.82,38.07 126.07,39.32 v1(126.07,39.95)
  Bottom Layer w0.254: v1(126.07,39.95) 126.07,41.48 127.96,43.37 127.96,57.83 127.27,58.52 v1(127,58.52)
SUB12: length 106.4
  Top Layer w0.254: v1(131.58,21.23) 131.58,16.93 131.48,16.83 ; U14.1 189.6,54.7 188.01,56.29 184.36,56.29 v1(178.75,50.69)
  Bottom Layer w0.254: v1(178.75,50.69) 176.91,50.69 175.66,51.93 174.11,51.93 173.7,52.34 170.29,52.34 168.52,52.82 162.88,54.19 150.43,56.57 149.32,56.69 141.04,57.92 139.87,56.75 139.87,26.9 139.51,26.54 136.48,26.54 135.46,27.56 134.26,27.56 133.78,27.08 133.78,23.43 v1(131.58,21.23)
SUB13: length 117.2
  Top Layer w0.254: v1(196.36,43.77) 202.53,49.94 206.57,49.94 U15.1 ; v1(133.38,20.63) 132.48,19.73 U38.28
  Bottom Layer w0.254: v1(196.36,43.77) 194.6,43.77 193.76,44.08 184.62,47.81 178.78,49.81 176.53,50.38 174.16,51.23 172.08,51.5 166.69,52.87 158.91,54.58 150.51,56.18 149.61,56.28 141.21,57.43 140.26,56.48 140.26,26.48 139.81,26.03 139.18,26.03 133.78,20.63 v1(133.38,20.63)
SUB14: length 130.3
  Top Layer w0.254: v1(212.01,35.88) 216.74,40.6 U16.1 ; v1(134.38,20.03) 133.48,19.13 U38.29
  Bottom Layer w0.254: v1(212.01,35.88) 210.76,35.88 205.81,38.43 195.71,42.93 183.72,47.63 174.01,50.72 172.04,51.06 169.11,51.83 160.21,53.93 150.11,55.83 141.51,56.91 141.32,56.91 140.68,56.28 140.68,26.25 140.01,25.58 139.93,25.58 v1(134.38,20.03)
SUB15: length 145.8
  Top Layer w0.254: v1(227.41,26.38) 229.53,26.38 234.88,31.73 236.46,31.73 U17.1 ; U38.30 134.48,18.63 v1(135.13,19.28)
  Bottom Layer w0.254: v1(227.41,26.38) 226.2,26.5 219.3,30.66 212.11,34.68 203.56,38.98 195.41,42.58 189.81,44.78 182.36,47.53 173.86,50.3 172.1,50.6 166.26,52.13 159.41,53.68 150.31,55.38 142.16,56.43 141.36,56.43 141.06,56.13 141.06,25.88 135.13,19.95 v1(135.13,19.28)

## Copper pours and planes (outline as drawn; the poured copper is in the pictures)
GND on Top Layer: -1.82,72.83 243.78,72.83 243.78,-2.17 -1.82,-2.17
GND on Bottom Layer: -1.92,73.23 244.28,73.23 244.28,-2.47 -1.92,-2.47

## Text on the board
Top Silkscreen Layer: 2026 STEP TRACER RAY
